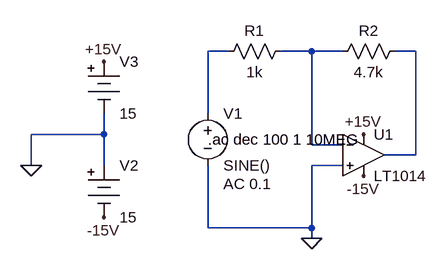
[diagram p0: schematic aufgabe2_invertierender_verstaerker_sinus2.asc]
aufgabe2_invertierender_verstaerker_sinus2.asc, the LTspice schematic file:
Version 4
SHEET 1 880 680
WIRE 48 176 16 176
WIRE 176 176 128 176
WIRE 224 176 176 176
WIRE 336 176 304 176
WIRE 16 272 16 176
WIRE -144 304 -144 272
WIRE -144 304 -256 304
WIRE 176 320 176 176
WIRE 224 320 176 320
WIRE 336 336 336 176
WIRE 336 336 288 336
WIRE -256 352 -256 304
WIRE -144 352 -144 304
WIRE 224 352 176 352
WIRE 16 448 16 352
WIRE 176 448 176 352
WIRE 176 448 16 448
WIRE 176 464 176 448
FLAG 176 464 0
FLAG 256 304 +15V
FLAG 256 368 -15V
FLAG -256 352 0
FLAG -144 432 -15V
FLAG -144 192 +15V
SYMBOL Opamps\\LT1014 256 272 R0
SYMATTR InstName U1
SYMBOL Misc\\battery -144 336 R0
WINDOW 123 0 0 Left 2
WINDOW 39 0 0 Left 2
SYMATTR InstName V2
SYMATTR Value 15
SYMBOL Misc\\battery -144 176 R0
WINDOW 123 0 0 Left 2
WINDOW 39 0 0 Left 2
SYMATTR InstName V3
SYMATTR Value 15
SYMBOL res 144 160 R90
WINDOW 0 0 56 VBottom 2
WINDOW 3 32 56 VTop 2
SYMATTR InstName R1
SYMATTR Value 1k
SYMBOL res 320 160 R90
WINDOW 0 0 56 VBottom 2
WINDOW 3 32 56 VTop 2
SYMATTR InstName R2
SYMATTR Value 4.7k
SYMBOL voltage 16 256 R0
WINDOW 123 24 124 Left 2
WINDOW 39 0 0 Left 2
SYMATTR Value2 AC 0.1
SYMATTR InstName V1
SYMATTR Value SINE()
TEXT 16 312 Left 2 !.ac dec 100 1 10MEG

The netlist it stands for:
* aufgabe2_invertierender_verstaerker_sinus2.asc
XU1 0 N002 +15V -15V N003 LT1014  ; pins In+ In- V+ V- OUT
V2 0 -15V 15
V3 +15V 0 15
R1 N002 N001 1k
R2 N003 N002 4.7k
V1 N001 0 SINE() AC 0.1
.ac dec 100 1 10MEG
.backanno
.end